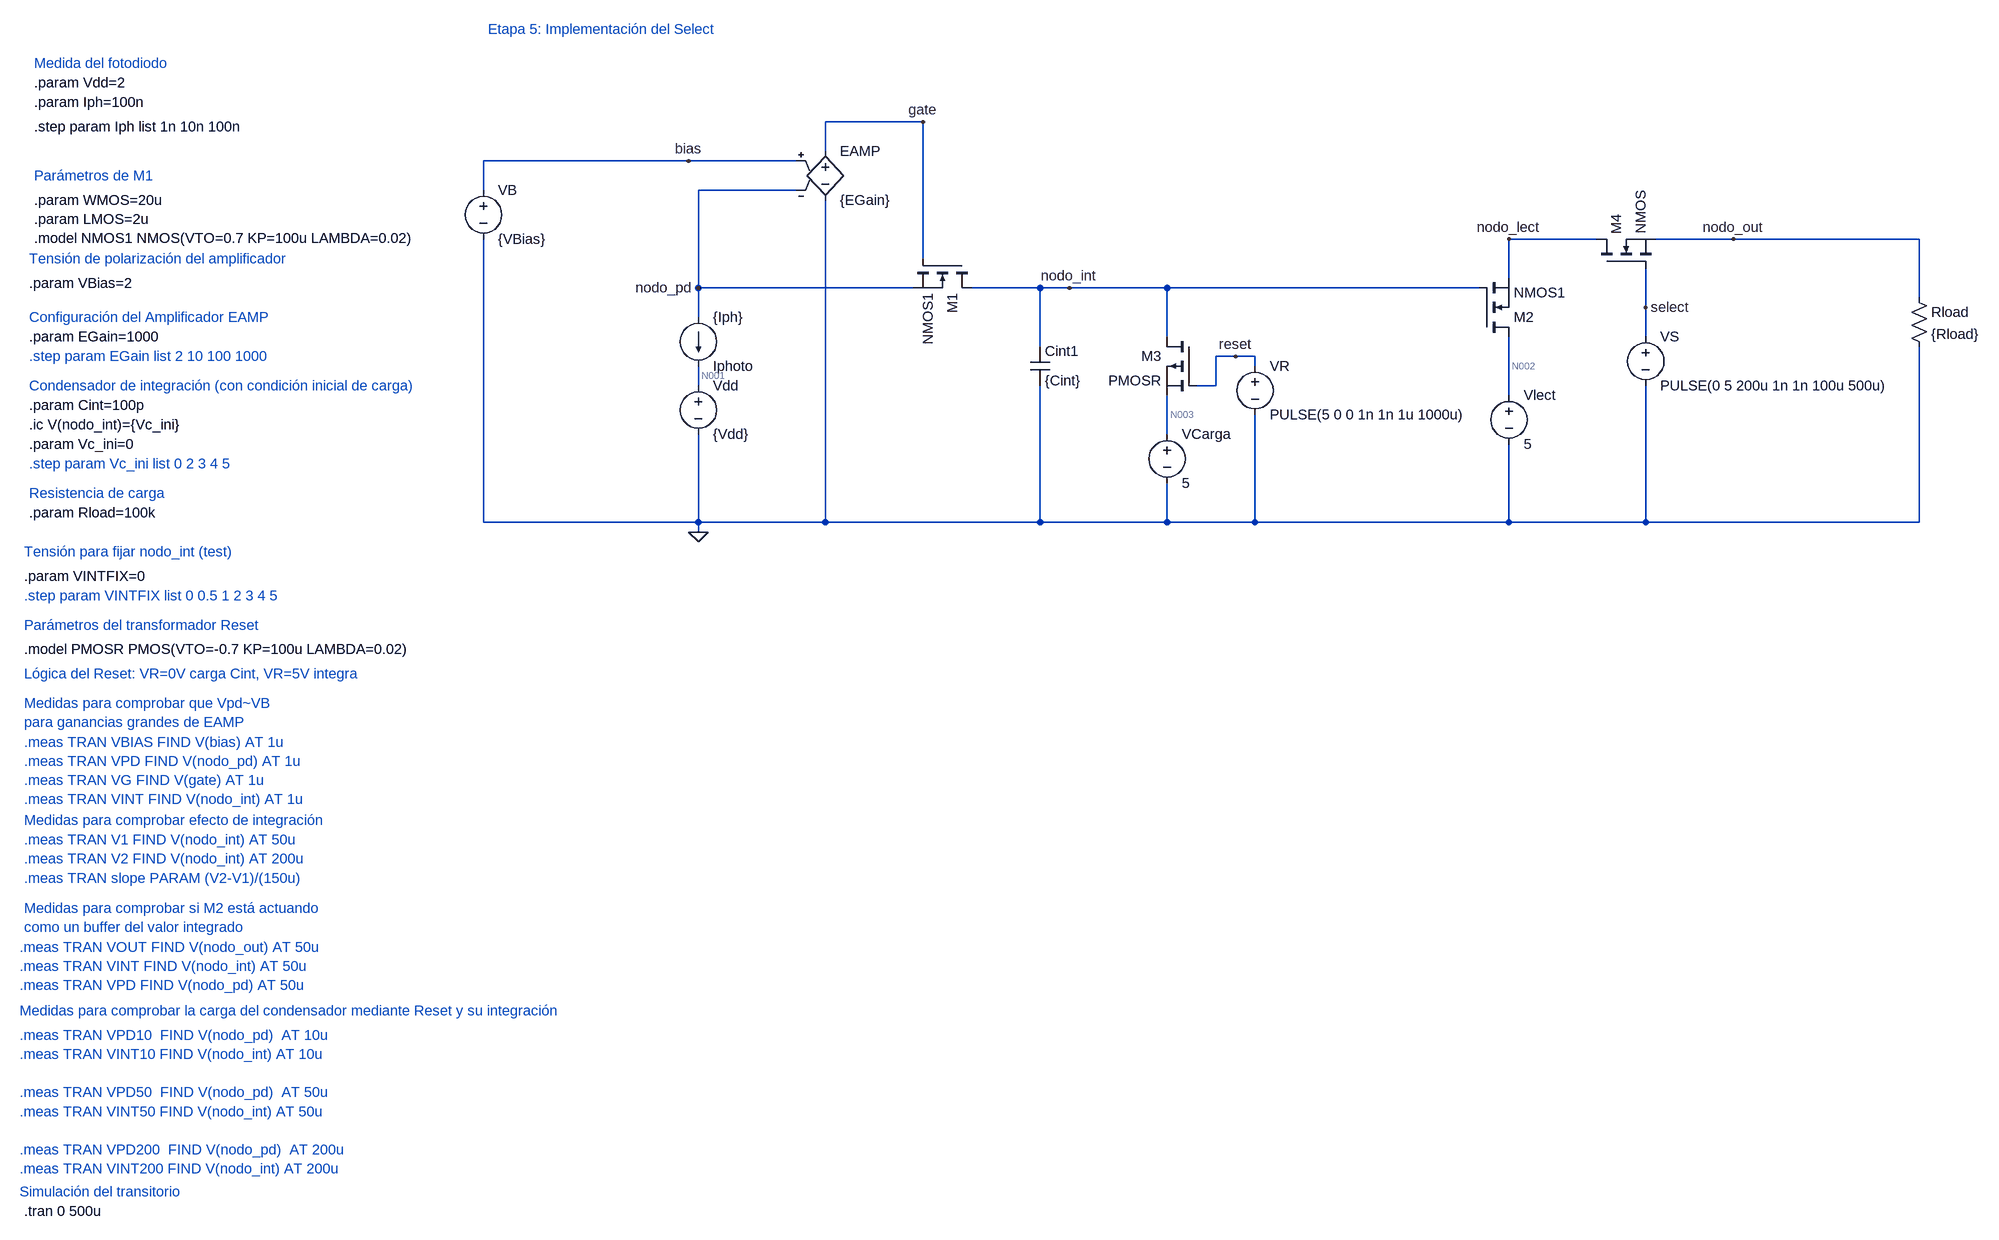
[diagram p0: schematic BDI_Etapa5.asc]
BDI_Etapa5.asc, the LTspice schematic file:
Version 4.1
SHEET 1 2260 1888
WIRE 512 32 352 32
WIRE 352 80 352 32
WIRE 128 96 -208 96
WIRE 304 96 128 96
WIRE -208 144 -208 96
WIRE 304 144 144 144
WIRE 1616 224 1472 224
WIRE 1840 224 1712 224
WIRE 2144 224 1840 224
WIRE 512 256 512 32
WIRE 1472 288 1472 224
WIRE 144 304 144 144
WIRE 496 304 144 304
WIRE 704 304 592 304
WIRE 752 304 704 304
WIRE 912 304 752 304
WIRE 1424 304 912 304
WIRE 2144 320 2144 224
WIRE 1696 336 1696 272
WIRE 144 352 144 304
WIRE 912 384 912 304
WIRE 1696 384 1696 336
WIRE 704 400 704 304
WIRE 1024 416 992 416
WIRE 1056 416 1024 416
WIRE 1056 432 1056 416
WIRE 144 464 144 432
WIRE 992 464 992 416
WIRE 992 464 960 464
WIRE 1472 480 1472 384
WIRE 912 544 912 480
WIRE -208 688 -208 224
WIRE 144 688 144 544
WIRE 144 688 -208 688
WIRE 352 688 352 160
WIRE 352 688 144 688
WIRE 704 688 704 464
WIRE 704 688 352 688
WIRE 912 688 912 624
WIRE 912 688 704 688
WIRE 1056 688 1056 512
WIRE 1056 688 912 688
WIRE 1472 688 1472 560
WIRE 1472 688 1056 688
WIRE 1696 688 1696 464
WIRE 1696 688 1472 688
WIRE 2144 688 2144 400
WIRE 2144 688 1696 688
WIRE 144 704 144 688
FLAG 144 704 0
FLAG 144 304 nodo_pd
FLAG 512 32 gate
FLAG 128 96 bias
FLAG 752 304 nodo_int
FLAG 1840 224 nodo_out
FLAG 1024 416 reset
FLAG 1472 224 nodo_lect
FLAG 1696 336 select
SYMBOL e 352 64 R0
SYMATTR InstName EAMP
SYMATTR Value {EGain}
SYMBOL voltage -208 128 R0
SYMATTR InstName VB
SYMATTR Value {VBias}
SYMBOL current 144 352 R0
WINDOW 0 24 80 Left 2
WINDOW 3 24 0 Left 2
WINDOW 123 0 0 Left 0
WINDOW 39 0 0 Left 0
SYMATTR InstName Iphoto
SYMATTR Value {Iph}
SYMBOL nmos 592 256 R90
SYMATTR InstName M1
SYMATTR Value NMOS1
SYMATTR SpiceLine L={LMOS} W={WMOS}
SYMBOL voltage 144 448 R0
SYMATTR InstName Vdd
SYMATTR Value {Vdd}
SYMBOL cap 688 400 R0
SYMATTR InstName Cint1
SYMATTR Value {Cint}
SYMBOL res 2128 304 R0
SYMATTR InstName Rload
SYMATTR Value {Rload}
SYMBOL nmos 1424 384 M180
SYMATTR InstName M2
SYMATTR Value NMOS1
SYMBOL pmos 960 384 M0
SYMATTR InstName M3
SYMATTR Value PMOSR
SYMBOL voltage 1056 416 R0
WINDOW 123 0 0 Left 0
WINDOW 39 0 0 Left 0
SYMATTR InstName VR
SYMATTR Value PULSE(5 0 0 1n 1n 1u 1000u)
SYMBOL voltage 912 528 R0
SYMATTR InstName VCarga
SYMATTR Value 5
SYMBOL voltage 1472 464 R0
SYMATTR InstName Vlect
SYMATTR Value 5
SYMBOL nmos 1616 272 R270
SYMATTR InstName M4
SYMBOL voltage 1696 368 R0
SYMATTR InstName VS
SYMATTR Value PULSE(0 5 200u 1n 1n 100u 500u)
TEXT -200 -120 Left 2 ;Etapa 5: Implementación del Select
TEXT -944 0 Left 2 !.param Iph=100n
TEXT -944 -64 Left 2 ;Medida del fotodiodo
TEXT -944 40 Left 2 !.step param Iph list 1n 10n 100n
TEXT -944 160 Left 2 !.param WMOS=20u\n.param LMOS=2u\n.model NMOS1 NMOS(VTO=0.7 KP=100u LAMBDA=0.02)
TEXT -944 120 Left 2 ;Parámetros de M1
TEXT -952 296 Left 2 !.param VBias=2
TEXT -952 256 Left 2 ;Tensión de polarización del amplificador
TEXT -960 984 Left 2 ;Medidas para comprobar que Vpd~VB \npara ganancias grandes de EAMP
TEXT -960 1816 Left 2 !.tran 0 500u
TEXT -960 1048 Left 2 ;.meas TRAN VBIAS FIND V(bias) AT 1u\n.meas TRAN VPD FIND V(nodo_pd) AT 1u\n.meas TRAN VG FIND V(gate) AT 1u\n.meas TRAN VINT FIND V(nodo_int) AT 1u
TEXT -944 -32 Left 2 !.param Vdd=2
TEXT -952 384 Left 2 !.param EGain=1000
TEXT -952 416 Left 2 ;.step param EGain list 2 10 100 1000
TEXT -952 352 Left 2 ;Configuración del Amplificador EAMP
TEXT -952 528 Left 2 !.ic V(nodo_int)={Vc_ini}
TEXT -952 464 Left 2 ;Condensador de integración (con condición inicial de carga)
TEXT -952 496 Left 2 !.param Cint=100p
TEXT -960 1208 Left 2 ;.meas TRAN V1 FIND V(nodo_int) AT 50u\n.meas TRAN V2 FIND V(nodo_int) AT 200u\n.meas TRAN slope PARAM (V2-V1)/(150u)
TEXT -960 1176 Left 2 ;Medidas para comprobar efecto de integración
TEXT -952 640 Left 2 ;Resistencia de carga
TEXT -952 672 Left 2 !.param Rload=100k
TEXT -968 1784 Left 2 ;Simulación del transitorio
TEXT -952 560 Left 2 !.param Vc_ini=0
TEXT -952 592 Left 2 ;.step param Vc_ini list 0 2 3 4 5
TEXT -960 1320 Left 2 ;Medidas para comprobar si M2 está actuando \ncomo un buffer del valor integrado
TEXT -968 1384 Left 2 ;.meas TRAN VOUT FIND V(nodo_out) AT 50u\n.meas TRAN VINT FIND V(nodo_int) AT 50u\n.meas TRAN VPD FIND V(nodo_pd) AT 50u
TEXT -960 808 Left 2 ;.step param VINTFIX list 0 0.5 1 2 3 4 5
TEXT -960 776 Left 2 !.param VINTFIX=0
TEXT -960 736 Left 2 ;Tensión para fijar nodo_int (test)
TEXT -960 856 Left 2 ;Parámetros del transformador Reset
TEXT -960 896 Left 2 !.model PMOSR PMOS(VTO=-0.7 KP=100u LAMBDA=0.02)
TEXT -960 936 Left 2 ;Lógica del Reset: VR=0V carga Cint, VR=5V integra
TEXT -968 1488 Left 2 ;Medidas para comprobar la carga del condensador mediante Reset y su integración
TEXT -968 1528 Left 2 ;.meas TRAN VPD10  FIND V(nodo_pd)  AT 10u\n.meas TRAN VINT10 FIND V(nodo_int) AT 10u\n \n.meas TRAN VPD50  FIND V(nodo_pd)  AT 50u\n.meas TRAN VINT50 FIND V(nodo_int) AT 50u\n \n.meas TRAN VPD200  FIND V(nodo_pd)  AT 200u\n.meas TRAN VINT200 FIND V(nodo_int) AT 200u

The netlist it stands for:
* BDI_Etapa5.asc
EAMP gate 0 bias nodo_pd {EGain}
VB bias 0 {VBias}
Iphoto nodo_pd N001 {Iph}
M1 nodo_int gate nodo_pd nodo_pd NMOS1 L={LMOS} W={WMOS}
Vdd N001 0 {Vdd}
Cint1 nodo_int 0 {Cint}
Rload nodo_out 0 {Rload}
M2 N002 nodo_int nodo_lect nodo_lect NMOS1
M3 nodo_int reset N003 N003 PMOSR
VR reset 0 PULSE(5 0 0 1n 1n 1u 1000u)
VCarga N003 0 5
Vlect N002 0 5
M4 nodo_lect select nodo_out nodo_out NMOS
VS select 0 PULSE(0 5 200u 1n 1n 100u 500u)
.model NMOS NMOS
.model PMOS PMOS
.lib standard.mos
* Etapa 5: Implementación del Select
.param Iph=100n
* Medida del fotodiodo
.step param Iph list 1n 10n 100n
.param WMOS=20u
.param LMOS=2u
.model NMOS1 NMOS(VTO=0.7 KP=100u LAMBDA=0.02)
* Parámetros de M1
.param VBias=2
* Tensión de polarización del amplificador
* Medidas para comprobar que Vpd~VB
* para ganancias grandes de EAMP
.tran 0 500u
* .meas TRAN VBIAS FIND V(bias) AT 1u
* .meas TRAN VPD FIND V(nodo_pd) AT 1u
* .meas TRAN VG FIND V(gate) AT 1u
* .meas TRAN VINT FIND V(nodo_int) AT 1u
.param Vdd=2
.param EGain=1000
* .step param EGain list 2 10 100 1000
* Configuración del Amplificador EAMP
.ic V(nodo_int)={Vc_ini}
* Condensador de integración (con condición inicial de carga)
.param Cint=100p
* .meas TRAN V1 FIND V(nodo_int) AT 50u
* .meas TRAN V2 FIND V(nodo_int) AT 200u
* .meas TRAN slope PARAM (V2-V1)/(150u)
* Medidas para comprobar efecto de integración
* Resistencia de carga
.param Rload=100k
* Simulación del transitorio
.param Vc_ini=0
* .step param Vc_ini list 0 2 3 4 5
* Medidas para comprobar si M2 está actuando
* como un buffer del valor integrado
* .meas TRAN VOUT FIND V(nodo_out) AT 50u
* .meas TRAN VINT FIND V(nodo_int) AT 50u
* .meas TRAN VPD FIND V(nodo_pd) AT 50u
* .step param VINTFIX list 0 0.5 1 2 3 4 5
.param VINTFIX=0
* Tensión para fijar nodo_int (test)
* Parámetros del transformador Reset
.model PMOSR PMOS(VTO=-0.7 KP=100u LAMBDA=0.02)
* Lógica del Reset: VR=0V carga Cint, VR=5V integra
* Medidas para comprobar la carga del condensador mediante Reset y su integración
* .meas TRAN VPD10  FIND V(nodo_pd)  AT 10u
* .meas TRAN VINT10 FIND V(nodo_int) AT 10u
* .meas TRAN VPD50  FIND V(nodo_pd)  AT 50u
* .meas TRAN VINT50 FIND V(nodo_int) AT 50u
* .meas TRAN VPD200  FIND V(nodo_pd)  AT 200u
* .meas TRAN VINT200 FIND V(nodo_int) AT 200u
.backanno
.end

* Results of the author's LTspice run, read from the files saved beside the schematic
* Operating Point (first step), zero values left out:
*   V(bias) = 2 V
*   V(gate) = 2 kV
*   V(n001) = 2 V
*   V(n002) = 5 V
*   V(n003) = 5 V
*   V(nodo_lect) = 2.5 V
*   V(reset) = 5 V
*   I(Iphoto) = 1 nA
*   I(Rload) = 5.01 pA
*   I(VCarga) = -10.01 pA
*   I(Vdd) = 1 nA
*   I(Vlect) = -5.01 pA
*   Ib(M2) = -2.51 pA
*   Ib(M3) = 5.01 pA
*   Ib(M4) = -2.51 pA
*   Id(M1) = 1 nA
*   Id(M2) = 5.01 pA
*   Id(M3) = -10.01 pA
*   Id(M4) = 5.01 pA
*   Is(M1) = -1 nA
*   Is(M2) = -2.5 pA
*   Is(M3) = 5 pA
*   Is(M4) = -2.5 pA
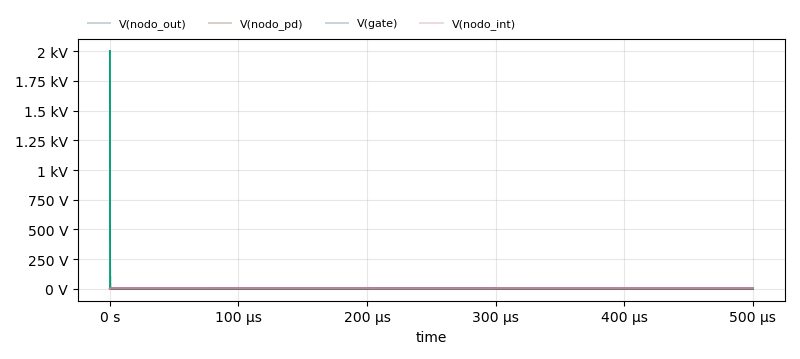
[diagram p1: Transient Analysis of BDI_Etapa5.asc, plotted from the saved traces]
* Transient Analysis, 3 runs:
*   V(nodo_out) [iph=1e-09]: min 472.7 nV, max 2.726 V, average 545.2 mV, rms 1.219 V, last 833.1 nV
*   V(nodo_out) [iph=1e-08]: min 472.7 nV, max 2.719 V, average 543.2 mV, rms 1.215 V, last 824.8 nV
*   V(nodo_out) [iph=1e-07]: min 472.7 nV, max 2.622 V, average 518.8 mV, rms 1.16 V, last 734.9 nV
*   V(nodo_pd) [iph=1e-09]: min 0 V, max 1.997 V, average 1.997 V, rms 1.997 V, last 1.997 V
*   V(nodo_pd) [iph=1e-08]: min 0 V, max 1.997 V, average 1.997 V, rms 1.997 V, last 1.997 V
*   V(nodo_pd) [iph=1e-07]: min 0 V, max 1.997 V, average 1.997 V, rms 1.997 V, last 1.997 V
*   V(gate) [iph=1e-09]: min 2.699 V, max 2 kV, average 3.145 V, rms 24.13 V, last 2.699 V
*   V(gate) [iph=1e-08]: min 2.702 V, max 2 kV, average 3.148 V, rms 24.13 V, last 2.702 V
*   V(gate) [iph=1e-07]: min 2.711 V, max 2 kV, average 3.158 V, rms 24.13 V, last 2.711 V
*   V(nodo_int) [iph=1e-09]: min 0 V, max 4.866 V, average 4.86 V, rms 4.861 V, last 4.861 V
*   V(nodo_int) [iph=1e-08]: min 0 V, max 4.869 V, average 4.841 V, rms 4.842 V, last 4.819 V
*   V(nodo_int) [iph=1e-07]: min 0 V, max 4.869 V, average 4.617 V, rms 4.62 V, last 4.37 V